# Altium project 3kWBatteryCharger.PrjPcb
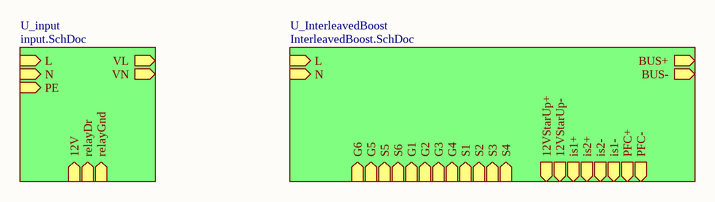
[diagram p0: 3kWBatteryCharger.SchDoc]
4 sheets, 63 parts. Net scope: hierarchical (ports join the sheet entries above them; power ports are global).
Sheets:
  3kWBatteryCharger.SchDoc
    U_InterleavedBoost = InterleavedBoost.SchDoc
    U_input = input.SchDoc
  auxPower.SchDoc

## Sheet 3kWBatteryCharger.SchDoc
size A4

### Sub-sheets
U_input = input.SchDoc: L (in), N (in), PE (in), VL (out), VN (out), 12V (in), relayDr (in), relayGnd (in)
U_InterleavedBoost = InterleavedBoost.SchDoc: BUS+ (out), BUS- (out), L (in), N (in), 12VStarUp+ (out), G6 (in), G5 (in), S5 (in), S6 (in), 12VStarUp- (out), G1 (in), G2 (in), G3 (in), G4 (in), S1 (in), S2 (in), S3 (in), S4 (in), is1+ (out), is2+ (out), is2- (out), is1- (out), PFC+ (out), PFC- (out)

### Nets
BUS-: sheet U_InterleavedBoost/BUS-, sheet U_InterleavedBoost/12VStarUp-, sheet U_InterleavedBoost/S3, sheet U_InterleavedBoost/S4, sheet U_InterleavedBoost/is2-, sheet U_InterleavedBoost/is1-, sheet U_InterleavedBoost/PFC-
NetC?#6_2: sheet U_InterleavedBoost/L, sheet U_InterleavedBoost/S1
NetC?#7_2: sheet U_InterleavedBoost/N, sheet U_InterleavedBoost/S2
NetQ5_3: sheet U_InterleavedBoost/S5, sheet U_InterleavedBoost/is1+
NetQ6_3: sheet U_InterleavedBoost/S6, sheet U_InterleavedBoost/is2+

### Notes on the sheet
- Title
- Size:
- Date:
- A4
- Number:
- Time:
- Revision:
- Sheet
- of
- File:

## Sheet InterleavedBoost.SchDoc
size A4
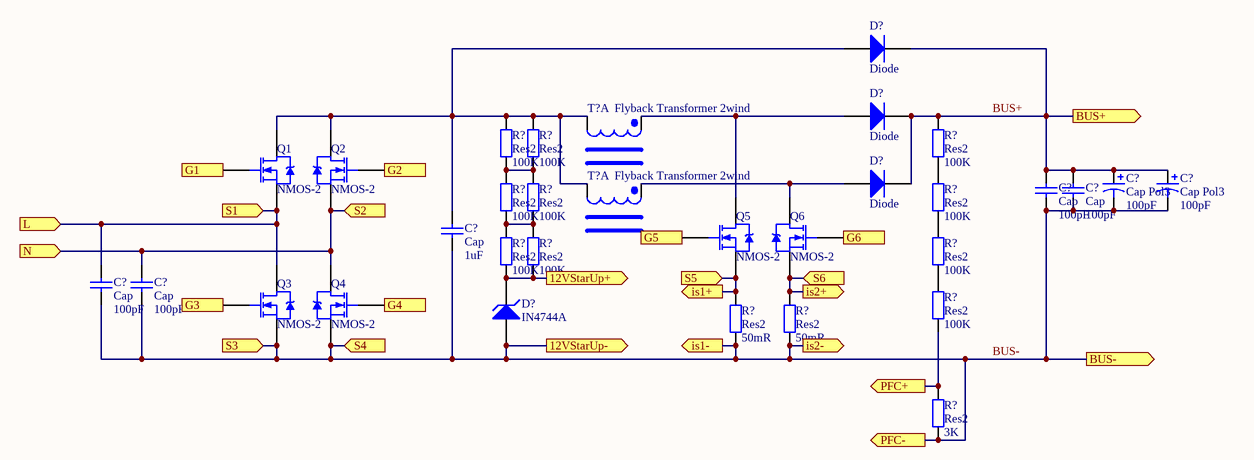
[diagram p1: InterleavedBoost.SchDoc]

### Parts
(Parts that share a designator on the sheet are numbered #1, #2 ... from top to bottom, then left to right.)
C?#1  Cap Pol3  value 100pF  [C0805]
C?#2  Cap Pol3  value 100pF  [C0805]
C?#3  Cap  value 100pF  [RAD-0.3]
C?#4  Cap  value 100pF  [RAD-0.3]
C?#5  Cap  value 1uF  [RAD-0.3]
C?#6  Cap  value 100pF  [RAD-0.3]
C?#7  Cap  value 100pF  [RAD-0.3]
D?#1  Diode  [SMC]
D?#2  Diode  [SMC]
D?#3  Diode  [SMC]
D?#4  IN4744A  [DIODE-0.7]
Q1  NMOS-2  [TO-220AB]
Q2  NMOS-2  [TO-220AB]
Q3  NMOS-2  [TO-220AB]
Q4  NMOS-2  [TO-220AB]
Q5  NMOS-2  [TO-220AB]
Q6  NMOS-2  [TO-220AB]
R?#1  Res2  value 100K  [AXIAL-0.4]
R?#2  Res2  value 100K  [AXIAL-0.4]
R?#3  Res2  value 100K  [AXIAL-0.4]
R?#4  Res2  value 100K  [AXIAL-0.4]
R?#5  Res2  value 100K  [AXIAL-0.4]
R?#6  Res2  value 100K  [AXIAL-0.4]
R?#7  Res2  value 100K  [AXIAL-0.4]
R?#8  Res2  value 100K  [AXIAL-0.4]
R?#9  Res2  value 100K  [AXIAL-0.4]
R?#10  Res2  value 100K  [AXIAL-0.4]
R?#11  Res2  value 50mR  [AXIAL-0.4]
R?#12  Res2  value 50mR  [AXIAL-0.4]
R?#13  Res2  value 3K  [AXIAL-0.4]
T?#1  Flyback Transformer 2wind  (part A of 2)
T?#2  Flyback Transformer 2wind  (part A of 2)

### Ports
12VStarUp+ (out), 12VStarUp- (out), BUS+ (out), BUS- (out), G1 (in), G2 (in), G3 (in), G4 (in), G5 (in), G6 (in), is1+ (out), is1- (out), is2+ (out), is2- (out), L (in), N (in), PFC+ (out), PFC- (out), S1 (in), S2 (in), S3 (in), S4 (in), S5 (in), S6 (in)

### Nets
BUS+: C?#1.1 C?#2.1 C?#3.2 C?#4.2 D?#1.2(K) D?#2.2(K) D?#3.2(K) R?#3.2 ; port BUS+
BUS-: C?#1.2 C?#2.2 C?#3.1 C?#4.1 C?#5.1 C?#6.1 C?#7.1 D?#4.1(A) Q3.3(S) Q4.3(S) R?#11.1 R?#12.1 R?#13.1 ; port BUS-, port 12VStarUp-, port S3, port S4, port is2-, port is1-, port PFC-
NetC?#5_2: C?#5.2 D?#1.1(A) Q1.2(D) Q2.2(D) R?#1.2 R?#2.2 T?#1.2 T?#2.2
NetC?#6_2: C?#6.2 Q1.3(S) Q3.2(D) ; port L, port S1
NetC?#7_2: C?#7.2 Q2.3(S) Q4.2(D) ; port N, port S2
NetD?#2_1: D?#2.1(A) Q5.2(D) T?#1.1
NetD?#3_1: D?#3.1(A) Q6.2(D) T?#2.1
NetD?#4_2: D?#4.2(K) R?#7.1 R?#8.1 ; port 12VStarUp+
NetQ1_1: Q1.1(G) ; port G1
NetQ2_1: Q2.1(G) ; port G2
NetQ3_1: Q3.1(G) ; port G3
NetQ4_1: Q4.1(G) ; port G4
NetQ5_1: Q5.1(G) ; port G5
NetQ5_3: Q5.3(S) R?#11.2 ; port S5, port is1+
NetQ6_1: Q6.1(G) ; port G6
NetQ6_3: Q6.3(S) R?#12.2 ; port S6, port is2+
NetR?#1_1: R?#1.1 R?#2.1 R?#4.2 R?#5.2
NetR?#3_1: R?#3.1 R?#6.2
NetR?#4_1: R?#4.1 R?#5.1 R?#7.2 R?#8.2
NetR?#6_1: R?#6.1 R?#9.2
NetR?#9_1: R?#9.1 R?#10.2
NetR?#10_1: R?#10.1 R?#13.2 ; port PFC+

### Notes on the sheet
- Title
- Size:
- Date:
- A4
- Number:
- Time:
- Revision:
- Sheet
- of
- File:

### Library data of the parts
C?#1 C?#2 = Cap Pol3: Polarized Capacitor (Surface Mount); Published: 8-Jun-2000; LatestRevisionDate: 29-May-2009; LatestRevisionNote: IPC-7351 Footprint Added.; PackageReference: C0805; Publisher: Altium Limited; PackageDescription: Chip Capacitor
C?#3-C?#7 = Cap: Capacitor; Published: 8-Jun-2000; LatestRevisionDate: 17-Jul-2002; LatestRevisionNote: Re-released for DXP Platform.; PackageReference: RAD-0.3; Publisher: Altium Limited; PackageDescription: Radial Cap, Thru-Hole; 2 Leads; 0.3 in Pin Spacing
D?#1-D?#3 = Diode: Default Diode; Published: 8-Jun-2000; LatestRevisionDate: 17-Jul-2002; LatestRevisionNote: Re-released for DXP Platform.; PackageVersion: Sep-1996; PackageReference: SMC; Publisher: Altium Limited; PackageDescription: DO-214-AB/SMC; 2 C-Bend Leads; Body 7.9 x 5.9 mm, inc. leads (LxW); Code_JEDEC: DO-214-AB
D?#4 = D Zener: Zener Diode; Published: 8-Jun-2000; LatestRevisionDate: 17-Jul-2002; LatestRevisionNote: Re-released for DXP Platform.; PackageReference: DIODE-0.7; Publisher: Altium Limited; PackageDescription: Diode, Thru-Hole; 2 Leads; 0.7 in Pin Spacing
Q1-Q6 = NMOS-2: N-Channel Power MOSFET; Note: Pin 2 is electrically connected to pin 4.; Published: 8-Jun-2000; LatestRevisionDate: 17-Jul-2002; LatestRevisionNote: Re-released for DXP Platform.; DatasheetVersion: PD-9.814; PackageVersion: Feb-1997; PackageReference: TO-220AB; Publisher: Altium Limited; PackageDescription: TO, Thru-Hole, Vertical, Heatsink Mounted; 3 In-Line Leads; Pitch 2.54 mm; ComponentLink1Description: Manufacturer Link; ComponentLink1URL: http://www.irf.com/
R?#1-R?#13 = Res2: Resistor; Published: 8-Jun-2000; LatestRevisionDate: 17-Jul-2002; LatestRevisionNote: Re-released for DXP Platform.; PackageReference: AXIAL-0.4; Publisher: Altium Limited; PackageDescription: Axial Device, Thru-Hole; 2 Leads; 0.4 in Pin Spacing

## Sheet input.SchDoc: Input
size A4
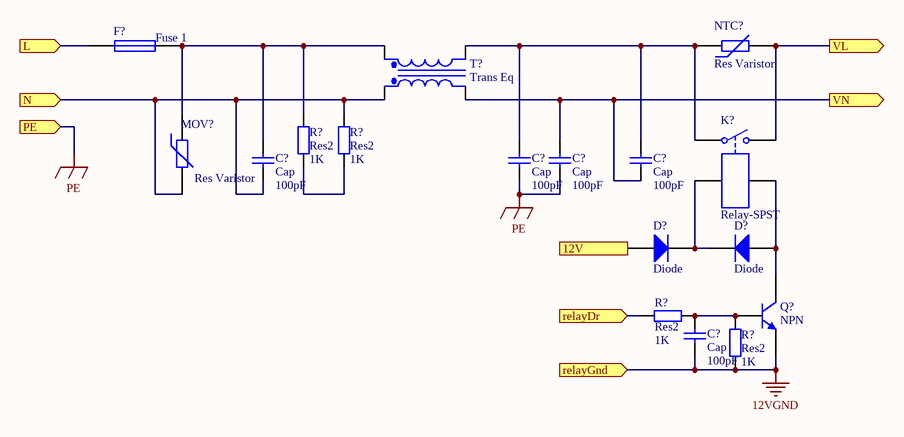
[diagram p2: input.SchDoc]

### Parts
(Parts that share a designator on the sheet are numbered #1, #2 ... from top to bottom, then left to right.)
C?#8  Cap  value 100pF  [RAD-0.3]
C?#9  Cap  value 100pF  [RAD-0.3]
C?#10  Cap  value 100pF  [RAD-0.3]
C?#11  Cap  value 100pF  [RAD-0.3]
C?#12  Cap  value 100pF  [RAD-0.3]
D?#5  Diode  [SMC]
D?#6  Diode  [SMC]
F?  Fuse 1  [PIN-W2/E2.8]
K?  Relay-SPST  [MODULE4]
MOV?  Res Varistor  [6-0805_N]
NTC?  Res Varistor  [6-0805_N]
Q?  NPN  [TO-226-AA]
R?#14  Res2  value 1K  [AXIAL-0.4]
R?#15  Res2  value 1K  [AXIAL-0.4]
R?#16  Res2  value 1K  [AXIAL-0.4]
R?#17  Res2  value 1K  [AXIAL-0.4]
T?#3  Trans Eq  [TRF_4]

### Ports
12V (in), L (in), N (in), PE (in), relayDr (in), relayGnd (in), VL (out), VN (out)

### Nets
12VGND: C?#12.1 Q?.3(E) R?#17.2 ; port relayGnd
PE: C?#9.1 C?#10.1 ; port PE
NetC?#8_1: C?#8.1 MOV?.2 R?#15.2 T?#3.1(Pri+) ; port N
NetC?#8_2: C?#8.2 F?.2 MOV?.1 R?#14.2 T?#3.3(Sec+)
NetC?#9_2: C?#9.2 C?#11.2 K?.1 NTC?.1 T?#3.4(Sec-)
NetC?#10_2: C?#10.2 C?#11.1 T?#3.2(Pri-) ; port VN
NetC?#12_2: C?#12.2 Q?.2(B) R?#16.1 R?#17.1
NetD?#5_1: D?#5.1(A) ; port 12V
NetD?#5_2: D?#5.2(K) D?#6.2(K) K?.3
NetD?#6_1: D?#6.1(A) K?.4 Q?.1(C)
NetF?_1: F?.1 ; port L
NetK?_2: K?.2 NTC?.2 ; port VL
NetR?#14_1: R?#14.1 R?#15.1
NetR?#16_2: R?#16.2 ; port relayDr

### Notes on the sheet
- Title
- Size:
- Date:
- A4
- Number:
- Time:
- Revision:
- Sheet
- of
- File:

### Library data of the parts
C?#8-C?#12 = Cap: Capacitor; Published: 8-Jun-2000; LatestRevisionDate: 17-Jul-2002; LatestRevisionNote: Re-released for DXP Platform.; PackageReference: RAD-0.3; Publisher: Altium Limited; PackageDescription: Radial Cap, Thru-Hole; 2 Leads; 0.3 in Pin Spacing
D?#5 D?#6 = Diode: Default Diode; Published: 8-Jun-2000; LatestRevisionDate: 17-Jul-2002; LatestRevisionNote: Re-released for DXP Platform.; PackageVersion: Sep-1996; PackageReference: SMC; Publisher: Altium Limited; PackageDescription: DO-214-AB/SMC; 2 C-Bend Leads; Body 7.9 x 5.9 mm, inc. leads (LxW); Code_JEDEC: DO-214-AB
F? = Fuse 1: Fuse; Published: 8-Jun-2000; LatestRevisionDate: 17-Jul-2002; LatestRevisionNote: Re-released for DXP Platform.; PackageReference: PIN-W2/E2.8; Publisher: Altium Limited; PackageDescription: Thru-Hole; 2 Leads
K? = Relay-SPST: Single-Pole Single-Throw Relay; Published: 24-Mar-1999; LatestRevisionDate: 17-Jul-2002; LatestRevisionNote: Re-released for DXP Platform.; PackageReference: MODULE4; Publisher: Altium Limited
MOV? NTC? = Res Varistor: Varistor (Voltage-Sensitive Resistor); Published: 24-Mar-1999; LatestRevisionDate: 29-May-2009; LatestRevisionNote: IPC-7351 Footprint Added.; PackageVersion: Mar-2003; PackageReference: 6-0805; Publisher: Altium Limited; PackageDescription: Chip Resistor 0805 Case Size; Code_IPC: RESC2012
Q? = NPN: NPN Bipolar Transistor; Published: 8-Jun-2000; LatestRevisionDate: 17-Jul-2002; LatestRevisionNote: Re-released for DXP Platform.; PackageReference: TO-226-AA; Publisher: Altium Limited; PackageDescription: TO, Flat Index; 3 In-Line, Axial Leads; Body Dia. 4.8mm; Leads 0.55 x 0.51 mm (max); Code_JEDEC: TO-226-AA
R?#14-R?#17 = Res2: Resistor; Published: 8-Jun-2000; LatestRevisionDate: 17-Jul-2002; LatestRevisionNote: Re-released for DXP Platform.; PackageReference: AXIAL-0.4; Publisher: Altium Limited; PackageDescription: Axial Device, Thru-Hole; 2 Leads; 0.4 in Pin Spacing
T?#3 = Trans Eq: Transformer (Equivalent Circuit Model); Published: 8-Jun-2000; LatestRevisionDate: 17-Jul-2002; LatestRevisionNote: Re-released for DXP Platform.; PackageReference: TRF_4; Publisher: Altium Limited; PackageDescription: Transformer; 4 Leads

## Sheet auxPower.SchDoc
size A4
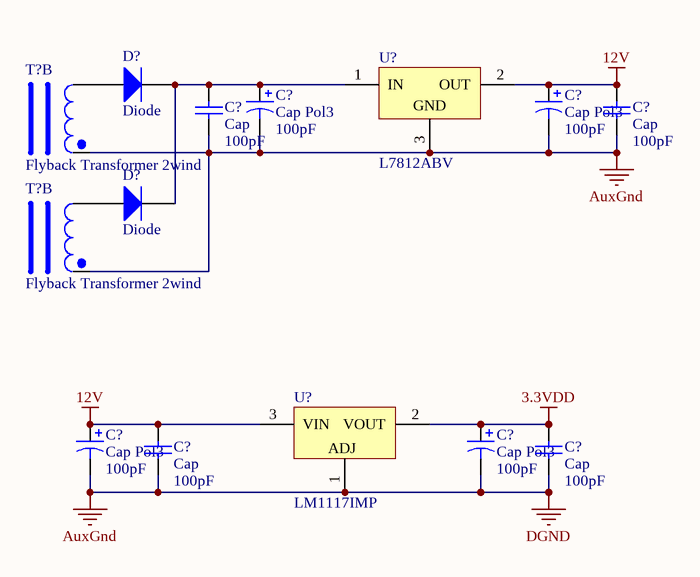
[diagram p3: auxPower.SchDoc]

### Parts
(Parts that share a designator on the sheet are numbered #1, #2 ... from top to bottom, then left to right.)
C?#13  Cap Pol3  value 100pF  [C0805]
C?#14  Cap Pol3  value 100pF  [C0805]
C?#15  Cap  value 100pF  [RAD-0.3]
C?#16  Cap  value 100pF  [RAD-0.3]
C?#17  Cap Pol3  value 100pF  [C0805]
C?#18  Cap Pol3  value 100pF  [C0805]
C?#19  Cap  value 100pF  [RAD-0.3]
C?#20  Cap  value 100pF  [RAD-0.3]
D?#7  Diode  [SMC]
D?#8  Diode  [SMC]
T?#4  Flyback Transformer 2wind  (part B of 2)
T?#5  Flyback Transformer 2wind  (part B of 2)
U?#1  L7812ABV  [TO220ABN]
U?#2  LM1117IMP

### Nets
3.3VDD: C?#18.1 C?#20.2 U?#2.2(VOUT)
12V: C?#14.1 C?#16.2 C?#17.1 C?#19.2 U?#1.2(OUT) U?#2.3(VIN)
AuxGnd: C?#13.2 C?#14.2 C?#15.1 C?#16.1 C?#17.2 C?#18.2 C?#19.1 C?#20.1 T?#4.4 T?#5.4 U?#1.3(GND) U?#2.1(ADJ)  [also labelled DGND]
NetC?#13_1: C?#13.1 C?#15.2 D?#7.2(K) D?#8.2(K) U?#1.1(IN)
NetD?#7_1: D?#7.1(A) T?#4.3
NetD?#8_1: D?#8.1(A) T?#5.3

Not connected (* = marked no-connect by the designer): U?#2 4(TAB)

### Notes on the sheet
- Title
- Size:
- Date:
- A4
- Number:
- Time:
- Revision:
- Sheet
- of
- File:

### Library data of the parts
C?#13 C?#14 C?#17 C?#18 = Cap Pol3: Polarized Capacitor (Surface Mount); Published: 8-Jun-2000; LatestRevisionDate: 29-May-2009; LatestRevisionNote: IPC-7351 Footprint Added.; PackageReference: C0805; Publisher: Altium Limited; PackageDescription: Chip Capacitor
C?#15 C?#16 C?#19 C?#20 = Cap: Capacitor; Published: 8-Jun-2000; LatestRevisionDate: 17-Jul-2002; LatestRevisionNote: Re-released for DXP Platform.; PackageReference: RAD-0.3; Publisher: Altium Limited; PackageDescription: Radial Cap, Thru-Hole; 2 Leads; 0.3 in Pin Spacing
D?#7 D?#8 = Diode: Default Diode; Published: 8-Jun-2000; LatestRevisionDate: 17-Jul-2002; LatestRevisionNote: Re-released for DXP Platform.; PackageVersion: Sep-1996; PackageReference: SMC; Publisher: Altium Limited; PackageDescription: DO-214-AB/SMC; 2 C-Bend Leads; Body 7.9 x 5.9 mm, inc. leads (LxW); Code_JEDEC: DO-214-AB
U?#1 = L7812ABV: Precision 1A Regulator; Published: 24-Aug-2001; LatestRevisionDate: 17-Jul-2002; LatestRevisionNote: Re-released for DXP Platform.; DatasheetVersion: Nov-1999; PackageVersion: Jun-1998; PackageReference: TO220ABN; Publisher: Altium Limited; PackageDescription: TO, Thru-Hole, Vertical, Heatsink Mounted; 3 In-Line Leads; Pitch 2.54 mm; Pin sequence 1, 3, 2; ComponentLink1Description: Manufacturer Link; ComponentLink1URL: http://www.st.com/; ComponentLink2Description: Datasheet; ComponentLink2URL: http://www.st.com/stonline/products/literature/ds/2144/l7805ab.pdf